# Altium project BDD_modul_ARM_v2.1.PrjPcb
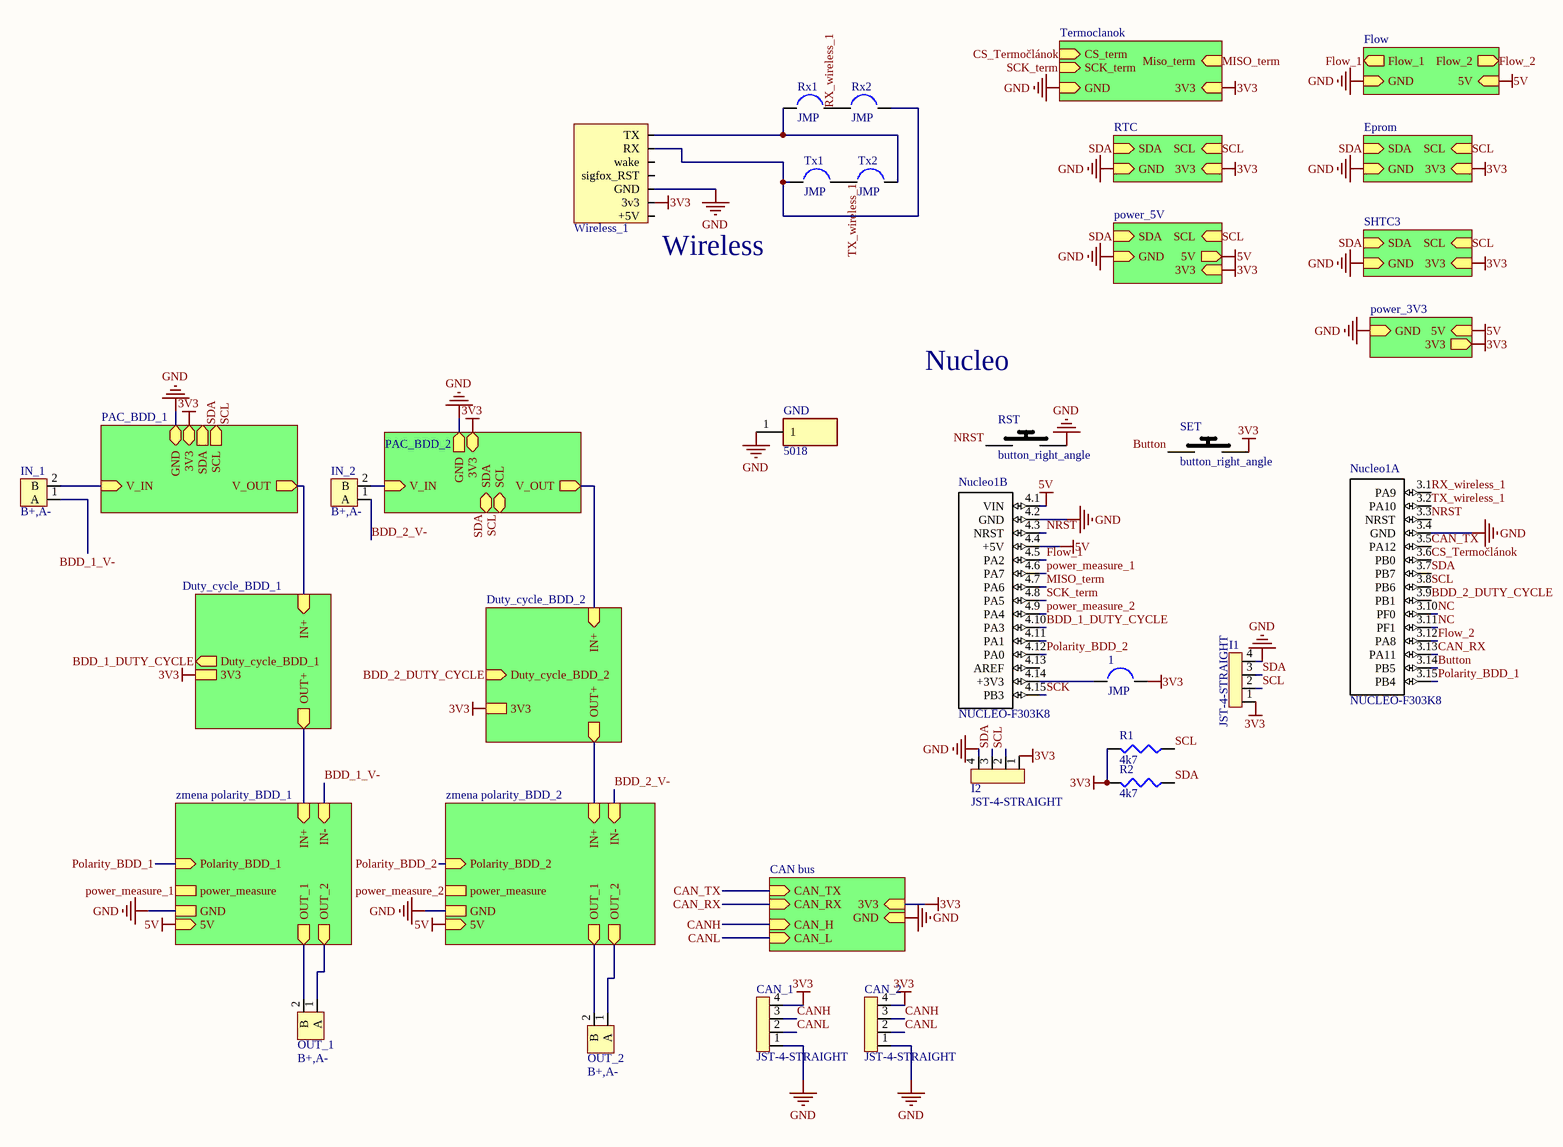
[diagram p0: BDD_modul_ARM_v2.1_Sheet.SchDoc]
16 sheets, 122 parts. Net scope: hierarchical (ports join the sheet entries above them; power ports are global).
Board files: BDD_modul_ARM_v2.1_PCB.PcbDoc, BDD_modul_ARM_v2.2_PCB.PcbDoc
Sheets:
  BDD_modul_ARM_v2.1_Sheet.SchDoc
    polarita_BDD_1 = zmena polarity_BDD_1.SchDoc
    polarita_BDD_2 = zmena polarity_BDD_2.SchDoc
    Duty_cycle_BDD_1 = Duty_cycle_BDD_1.SchDoc
    PAC_BDD_1 = PAC_BDD_1.SchDoc
    Duty_cycle_BDD_2 = Duty_cycle_BDD_2.SchDoc
    PAC_BDD_2 = PAC_BDD_2.SchDoc
    Designator = CAN bus.SchDoc
    Flow = Flow.SchDoc
    Eprom = Eprom.SchDoc
    Termoclanok = Termoclanok.SchDoc
    SHTC3 = SHTC3.SchDoc
    power_5V = power_5V.SchDoc
    power_3V3 = power_3V3.SchDoc
    RTC = RTC.SchDoc
  izolator.SchDoc

## Sheet BDD_modul_ARM_v2.1_Sheet.SchDoc
size A0

### Parts
(Parts that share a designator on the sheet are numbered #1, #2 ... from top to bottom, then left to right.)
1  JMP  [JMP]
CAN_1  JST-4-STRAIGHT  [JST-4-STRAIGHT]
CAN_2  JST-4-STRAIGHT  [JST-4-STRAIGHT]
GND#1  5018  [1508000150000030]
I1  JST-4-STRAIGHT  [JST-4-STRAIGHT]
I2  JST-4-STRAIGHT  [JST-4-STRAIGHT]
IN_1  B+,A-  [CON_2CH_PLUG]
IN_2  B+,A-  [CON_2CH_PLUG]
Nucleo1  NUCLEO-F303K8  [*MODULE_NUCLEO-F303K8_NUCLEO-F303K8(Primary)]  (parts A,B of 2)
OUT_1  B+,A-  [CON_2CH_PLUG]
OUT_2  B+,A-  [CON_2CH_PLUG]
R1  4k7  [J1-0603]
R2  4k7  [J1-0603]
RST  button_right_angle  [1825027-8]
Rx1  JMP  [JMP]
Rx2  JMP  [JMP]
SET  button_right_angle  [1825027-8]
Tx1  JMP  [JMP]
Tx2  JMP  [JMP]
Wireless_1  header7  [Wireless]  (value not drawn)

### Sub-sheets
Designator = CAN bus: 3V3 (in), CAN_TX (in), CAN_RX (in), GND (in), CAN_H (in), CAN_L (in)
Duty_cycle_BDD_1 = Duty_cycle_BDD_1: IN+ (in), OUT+ (out), Duty_cycle_BDD_1 (out), 3V3
Duty_cycle_BDD_2 = Duty_cycle_BDD_2: IN+ (in), OUT+ (out), Duty_cycle_BDD_2 (in), 3V3
Eprom = Eprom: 3V3 (in), GND (in), SDA (in), SCL (in)
Flow = Flow: GND (in), Flow_1 (out), Flow_2 (out), 5V (in)
PAC_BDD_1 = PAC_BDD_1: GND (bidir), 3V3 (bidir), V_IN (in), V_OUT (out), SDA (out), SCL (out)
PAC_BDD_2 = PAC_BDD_2: 3V3 (bidir), SDA (bidir), SCL (bidir), V_IN (in), V_OUT (out), GND (out)
polarita_BDD_1 = zmena polarity_BDD_1: Polarity_BDD_1 (in), IN+ (in), IN- (in), OUT_1 (out), OUT_2 (out), power_measure, GND, 5V (in)
polarita_BDD_2 = zmena polarity_BDD_2: Polarity_BDD_2 (in), IN+ (in), IN- (in), OUT_1 (out), OUT_2 (out), power_measure, GND, 5V (in)
power_3V3 = power_3V3: 5V (in), 3V3 (out), GND (in)
power_5V = power_5V: 5V (out), GND (in), SDA (in), SCL (in), 3V3 (in)
RTC = RTC: 3V3 (in), GND (in), SCL (in), SDA (in)
SHTC3 = SHTC3: SCL (in), SDA (in), GND (in), 3V3 (in)
Termoclanok = Termoclanok: 3V3 (in), Miso_term (in), GND (in), CS_term (in), SCK_term (in)

### Nets
3V3: 1.2 CAN_1.4 CAN_2.4 I1.1 I2.1 R1.2 R2.2 SET.2 Wireless_1.2(3v3) ; sheet Duty_cycle_BDD_1/3V3, sheet PAC_BDD_1/3V3, sheet Duty_cycle_BDD_2/3V3, sheet PAC_BDD_2/3V3, sheet Designator/3V3, sheet Eprom/3V3, sheet Termoclanok/3V3, sheet SHTC3/3V3, sheet power_5V/3V3, sheet power_3V3/3V3, sheet RTC/3V3
5V: Nucleo1.4.1(VIN) Nucleo1.4.4(+5V) ; sheet polarita_BDD_1/5V, sheet polarita_BDD_2/5V, sheet Flow/5V, sheet power_5V/5V, sheet power_3V3/5V
BDD1_Pac_+: IN_1.2(B) ; sheet PAC_BDD_1/V_IN
BDD1_Pac_-: sheet Duty_cycle_BDD_1/IN+, sheet PAC_BDD_1/V_OUT
BDD2_Pac_+: IN_2.2(B) ; sheet PAC_BDD_2/V_IN
BDD2_Pac_-: sheet Duty_cycle_BDD_2/IN+, sheet PAC_BDD_2/V_OUT
GND: CAN_1.1 CAN_2.1 GND#1.1 I1.4 I2.4 Nucleo1.3.4(GND) Nucleo1.4.2(GND) RST.2 Wireless_1.3(GND) ; sheet polarita_BDD_1/GND, sheet polarita_BDD_2/GND, sheet PAC_BDD_1/GND, sheet PAC_BDD_2/GND, sheet Designator/GND, sheet Flow/GND, sheet Eprom/GND, sheet Termoclanok/GND, sheet SHTC3/GND, sheet power_5V/GND, sheet power_3V3/GND, sheet RTC/GND
IN+_BDD_1: sheet polarita_BDD_1/IN+, sheet Duty_cycle_BDD_1/OUT+
IN+_BDD_2: sheet polarita_BDD_2/IN+, sheet Duty_cycle_BDD_2/OUT+
BDD_1_DUTY_CYCLE: Nucleo1.4.10(PA3) ; sheet Duty_cycle_BDD_1/Duty_cycle_BDD_1
BDD_1_V-: IN_1.1(A) ; sheet polarita_BDD_1/IN-
BDD_2_DUTY_CYCLE: Nucleo1.3.9(PB1) ; sheet Duty_cycle_BDD_2/Duty_cycle_BDD_2
BDD_2_V-: IN_2.1(A) ; sheet polarita_BDD_2/IN-
Button: Nucleo1.3.14(PB5) SET.1
CAN_RX: Nucleo1.3.13(PA11) ; sheet Designator/CAN_RX
CAN_TX: Nucleo1.3.5(PA12) ; sheet Designator/CAN_TX
CANH: CAN_1.3 CAN_2.3 ; sheet Designator/CAN_H
CANL: CAN_1.2 CAN_2.2 ; sheet Designator/CAN_L
CS_Termočlánok: Nucleo1.3.6(PB0) ; sheet Termoclanok/CS_term
Flow_1: Nucleo1.4.5(PA2) ; sheet Flow/Flow_1
Flow_2: Nucleo1.3.12(PA8) ; sheet Flow/Flow_2
MISO_term: Nucleo1.4.7(PA6) ; sheet Termoclanok/Miso_term
NC: Nucleo1.3.10(PF0) Nucleo1.3.11(PF1)
NRST: Nucleo1.3.3(NRST) Nucleo1.4.3(NRST) RST.1
OUT_1_BDD_1: OUT_1.2(B) ; sheet polarita_BDD_1/OUT_1
OUT_1_BDD_2: OUT_2.2(B) ; sheet polarita_BDD_2/OUT_1
OUT_2_BDD_1: OUT_1.1(A) ; sheet polarita_BDD_1/OUT_2
OUT_2_BDD_2: OUT_2.1(A) ; sheet polarita_BDD_2/OUT_2
Polarity_BDD_1: Nucleo1.3.15(PB4) ; sheet polarita_BDD_1/Polarity_BDD_1
Polarity_BDD_2: Nucleo1.4.12(PA0) ; sheet polarita_BDD_2/Polarity_BDD_2
power_measure_1: Nucleo1.4.6(PA7) ; sheet polarita_BDD_1/power_measure  [project net Measuring_voltage_1]
power_measure_2: Nucleo1.4.9(PA4) ; sheet polarita_BDD_2/power_measure  [project net Measuring_voltage_2]
RX_wireless_1: Nucleo1.3.1(PA9) Rx1.2 Rx2.1
SCK: Nucleo1.4.15(PB3)
SCK_term: Nucleo1.4.8(PA5) ; sheet Termoclanok/SCK_term
SCL: I1.2 I2.2 Nucleo1.3.8(PB6) R1.1 ; sheet PAC_BDD_1/SCL, sheet PAC_BDD_2/SCL, sheet Eprom/SCL, sheet SHTC3/SCL, sheet power_5V/SCL, sheet RTC/SCL
SDA: I1.3 I2.3 Nucleo1.3.7(PB7) R2.1 ; sheet PAC_BDD_1/SDA, sheet PAC_BDD_2/SDA, sheet Eprom/SDA, sheet SHTC3/SDA, sheet power_5V/SDA, sheet RTC/SDA
TX_wireless_1: Nucleo1.3.2(PA10) Tx1.2 Tx2.1
Net1_1: 1.1 Nucleo1.4.14(+3V3)
NetRx1_1: Rx1.1 Tx2.2 Wireless_1.7(TX)
NetRx2_2: Rx2.2 Tx1.1 Wireless_1.6(RX)

Not connected (* = marked no-connect by the designer): Nucleo1 4.11(PA1) 4.13(AREF); Wireless_1 1(+5V) 4(sigfox_RST) 5(wake)

### Notes on the sheet
- (near Wireless_1) Wireless
- Nucleo

### Library data of the parts
CAN_1 CAN_2 I1 I2 = JST-4-STRAIGHT: B4B-PH-K-S
GND#1 = 5018: Test Point; Manufacturer_Name: Keystone Electronics; Allied_Number: 71078148; Datasheet Link: https://www.keyelco.com/product-pdf.cfm?p=1356; Height: 2.29mm; Manufacturer_Part_Number: 5018; Mouser Part Number: 534-5018; Mouser Price/Stock: https://www.mouser.com/Search/Refine.aspx?Keyword=534-5018; Allied Price/Stock: https://www.alliedelec.com/keystone-electronics-5018/71078148/
IN_1 IN_2 OUT_1 OUT_2 = CON_2CH_PLUG: TBG-5.0-KW-2P
Nucleo1 = NUCLEO-F303K8: STM32 Nucleo-32 development board with STM32F303K8T6 MCU, supports Arduino connectivity; MF: STMicroelectronics; MP: NUCLEO-F303K8; Price: None; SnapEDA_Link: https://www.snapeda.com/parts/NUCLEO-F303K8/STMicroelectronics/view-part/?ref=snap; Availability: Unavailable; Package: None; Value: *
R1 R2 = Res3: Resistor; Value: 1K5; Published: 8-Jun-2000; LatestRevisionDate: 29-May-2009; LatestRevisionNote: IPC-7351 Footprint Added.; PackageReference: J1-0603; Publisher: Altium Limited; PackageDescription: Chip Resistor
RST SET = button_right_angle: Switch; Manufacturer_Name: TE Connectivity; Datasheet Link: http://www.te.com/commerce/DocumentDelivery/DDEController?Action=srchrtrv&DocNm=1825027&DocType=Customer+Drawing&DocLang=English; Manufacturer_Part_Number: 1825027-8; Mouser Part Number: 506-1825027-8; Mouser Price/Stock: https://www.mouser.com/Search/Refine.aspx?Keyword=506-1825027-8; RS Part Number: 7182389P; RS Price/Stock: http://uk.rs-online.com/web/p/products/7182389P
Wireless_1 = Wireless

## Sheet zmena polarity_BDD_1.SchDoc
size A4
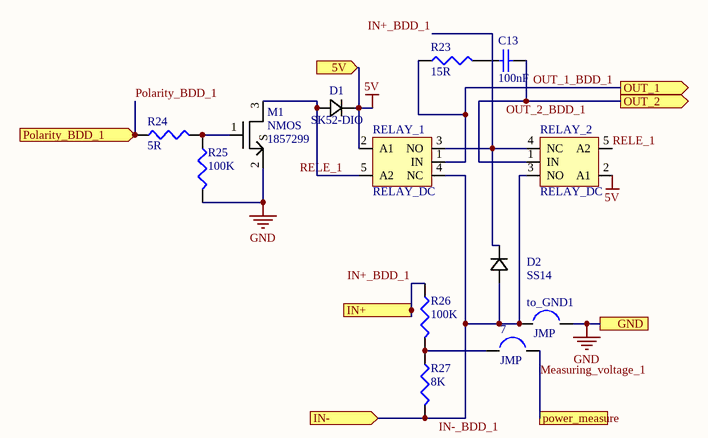
[diagram p1: zmena polarity_BDD_1.SchDoc]

### Parts
7  JMP  [JMP]
C13  100nF  [1608[0603]]
D1  SK52-DIO  [D5A20V]
D2  SS14  [D5A20V]
M1  NMOS  Supplier Part Number 1: 1857299  [SOT23]
R23  15R  [J1-0603]
R24  5R  [J1-0603]
R25  100K  [J1-0603]
R26  100K  [J1-0603]
R27  8K  [J1-0603]
RELAY_1  RELAY_DC  [RELAY_DC]
RELAY_2  RELAY_DC  [RELAY_DC]
to_GND1  JMP  [JMP]

### Ports
5V (in), GND, IN+ (in), IN- (in), OUT_1 (out), OUT_2 (out), Polarity_BDD_1 (in), power_measure

### Nets
5V: D1.1 RELAY_1.2(A1) RELAY_2.2(A1) ; port 5V
GND: M1.2(S) R25.2 to_GND1.2 ; port GND
IN+_BDD_1: D2.1 R26.1 RELAY_1.3(NO) RELAY_2.4(NC) ; port IN+
IN-_BDD_1: D2.2 R27.2 RELAY_1.4(NC) RELAY_2.3(NO) to_GND1.1 ; port IN-  [project net BDD_1_V-]
Measuring_voltage_1: 7.2 ; port power_measure
OUT_1_BDD_1: R23.1 RELAY_1.1(IN) ; port OUT_1
OUT_2_BDD_1: C13.2 RELAY_2.1(IN) ; port OUT_2
Polarity_BDD_1: R24.1 ; port Polarity_BDD_1
RELE_1: D1.2 M1.3(D) RELAY_1.5(A2) RELAY_2.5(A2)
Net7_1: 7.1 R26.2 R27.1
NetC13_1: C13.1 R23.2
NetM1_1: M1.1(G) R24.2 R25.1

### Library data of the parts
C13 = Cap Semi: Capacitor (Semiconductor SIM Model); Value: 100pF; Published: 8-Jun-2000; LatestRevisionDate: 29-May-2009; LatestRevisionNote: IPC-7351 Footprint Added.; PackageReference: C1206; Publisher: Altium Limited; PackageDescription: Chip Capacitor
D1 D2 = D_5A_20V
R23 = Res3: Resistor; Value: 2R; Published: 8-Jun-2000; LatestRevisionDate: 29-May-2009; LatestRevisionNote: IPC-7351 Footprint Added.; PackageReference: J1-0603; Publisher: Altium Limited; PackageDescription: Chip Resistor
R24-R27 = Res3: Resistor; Value: 200K; Published: 8-Jun-2000; LatestRevisionDate: 29-May-2009; LatestRevisionNote: IPC-7351 Footprint Added.; PackageReference: J1-0603; Publisher: Altium Limited; PackageDescription: Chip Resistor
RELAY_1 RELAY_2 = RELAY_DC: RM51-3011-85-1005
M1 = NMOS: Supplier 1: Farnell

## Sheet zmena polarity_BDD_2.SchDoc
size A0
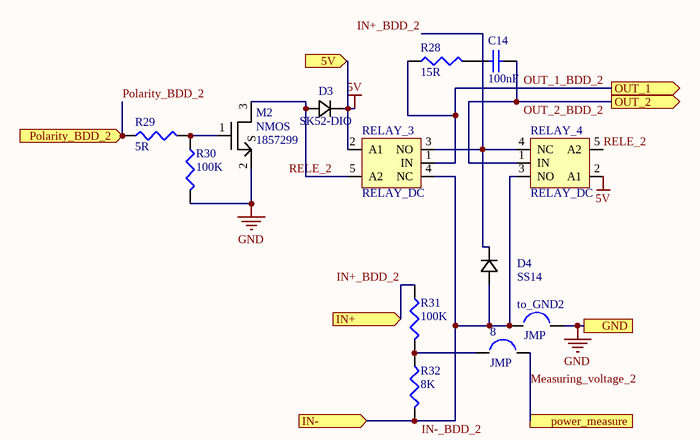
[diagram p2: zmena polarity_BDD_2.SchDoc]

### Parts
8  JMP  [JMP]
C14  100nF  [1608[0603]]
D3  SK52-DIO  [D5A20V]
D4  SS14  [D5A20V]
M2  NMOS  Supplier Part Number 1: 1857299  [SOT23]
R28  15R  [J1-0603]
R29  5R  [J1-0603]
R30  100K  [J1-0603]
R31  100K  [J1-0603]
R32  8K  [J1-0603]
RELAY_3  RELAY_DC  [RELAY_DC]
RELAY_4  RELAY_DC  [RELAY_DC]
to_GND2  JMP  [JMP]

### Ports
5V (in), GND, IN+ (in), IN- (in), OUT_1 (out), OUT_2 (out), Polarity_BDD_2 (in), power_measure

### Nets
5V: D3.1 RELAY_3.2(A1) RELAY_4.2(A1) ; port 5V
GND: M2.2(S) R30.2 to_GND2.2 ; port GND
IN+_BDD_2: D4.1 R31.1 RELAY_3.3(NO) RELAY_4.4(NC) ; port IN+
IN-_BDD_2: D4.2 R32.2 RELAY_3.4(NC) RELAY_4.3(NO) to_GND2.1 ; port IN-  [project net BDD_2_V-]
Measuring_voltage_2: 8.2 ; port power_measure
OUT_1_BDD_2: R28.1 RELAY_3.1(IN) ; port OUT_1
OUT_2_BDD_2: C14.2 RELAY_4.1(IN) ; port OUT_2
Polarity_BDD_2: R29.1 ; port Polarity_BDD_2
RELE_2: D3.2 M2.3(D) RELAY_3.5(A2) RELAY_4.5(A2)
Net8_1: 8.1 R31.2 R32.1
NetC14_1: C14.1 R28.2
NetM2_1: M2.1(G) R29.2 R30.1

### Library data of the parts
C14 = Cap Semi: as C13 on sheet zmena polarity_BDD_1; Published: 8-Jun-2000; LatestRevisionDate: 29-May-2009; LatestRevisionNote: IPC-7351 Footprint Added.; PackageReference: C1206; Publisher: Altium Limited; PackageDescription: Chip Capacitor
D3 D4 = D_5A_20V
R28 = Res3: Resistor; Value: 2R; Published: 8-Jun-2000; LatestRevisionDate: 29-May-2009; LatestRevisionNote: IPC-7351 Footprint Added.; PackageReference: J1-0603; Publisher: Altium Limited; PackageDescription: Chip Resistor
R29-R32 = Res3: Resistor; Value: 200K; Published: 8-Jun-2000; LatestRevisionDate: 29-May-2009; LatestRevisionNote: IPC-7351 Footprint Added.; PackageReference: J1-0603; Publisher: Altium Limited; PackageDescription: Chip Resistor
RELAY_3 RELAY_4 = RELAY_DC: RM51-3011-85-1005
M2 = NMOS: Supplier 1: Farnell

## Sheet Duty_cycle_BDD_1.SchDoc
size A4
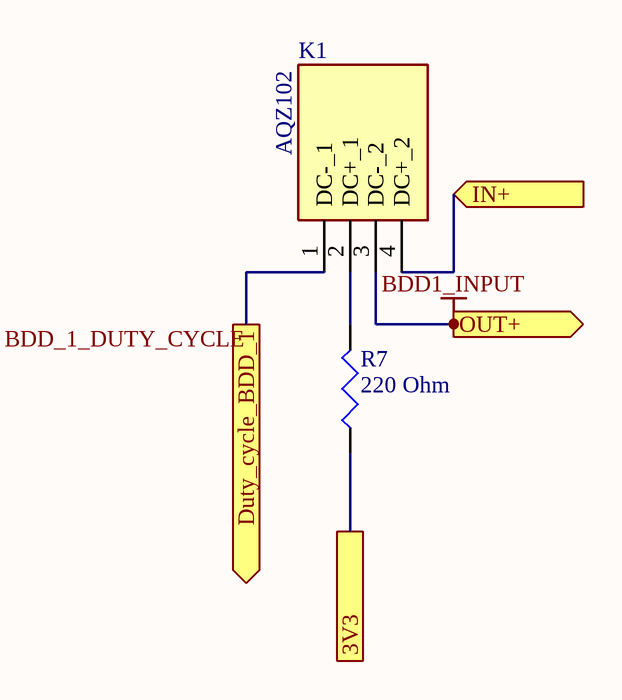
[diagram p3: Duty_cycle_BDD_1.SchDoc]

### Parts
K1  AQZ102  [AQZ102]
R7  220 Ohm  [J1-0603]

### Ports
3V3, Duty_cycle_BDD_1 (out), IN+ (in), OUT+ (out)

### Nets
3V3: R7.1 ; port 3V3
BDD1_INPUT: K1.3(DC-_2) ; port OUT+  [project net IN+_BDD_1]
BDD1_Pac_-: K1.4(DC+_2) ; port IN+
BDD_1_DUTY_CYCLE: K1.1(DC-_1) ; port Duty_cycle_BDD_1
NetK1_2: K1.2(DC+_1) R7.2

### Library data of the parts
K1 = AQZ102: Relay or Contactor; Manufacturer_Name: Panasonic; Datasheet Link: https://industrial.panasonic.com/ac/cdn/e/control/relay/photomos/catalog/semi_eng_pwr1a_aqz10_20.pdf; Height: 11mm; Manufacturer_Part_Number: AQZ102; Arrow Part Number: AQZ102; Arrow Price/Stock: https://www.arrow.com/en/products/aqz102/panasonic; Mouser Part Number: 769-AQZ102; Mouser Price/Stock: https://www.mouser.co.uk/ProductDetail/Panasonic-Industrial-Devices/AQZ102?qs=tR16lFwwUU%2FVYpsj8M3w%252BA%3D%3D
R7 = Res3: Resistor; Value: 10K; Published: 8-Jun-2000; LatestRevisionDate: 29-May-2009; LatestRevisionNote: IPC-7351 Footprint Added.; PackageReference: J1-0603; Publisher: Altium Limited; PackageDescription: Chip Resistor

## Sheet PAC_BDD_1.SchDoc
size A4
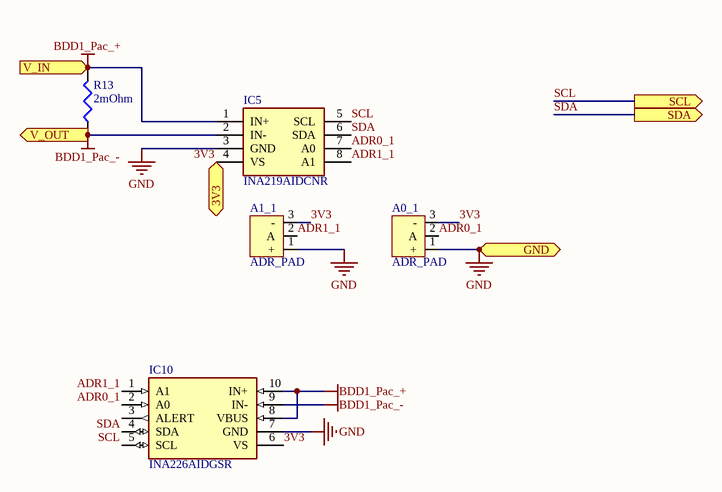
[diagram p4: PAC_BDD_1.SchDoc]

### Parts
A0_1  ADR_PAD  [SOLDER_PAD]
A1_1  ADR_PAD  [SOLDER_PAD]
IC5  INA219AIDCNR  [SOT65P280X145-8N]
IC10  INA226AIDGSR  [SOP50P490X110-10N]
R13  2mOhm  [RESC3216X75N]

### Ports
3V3 (bidir), GND (bidir), SCL (out), SDA (out), V_IN (in), V_OUT (out)

### Nets
3V3: A0_1.3(-) A1_1.3(-) IC5.4(VS) IC10.6(VS) ; port 3V3
BDD1_Pac_+: IC5.1(IN+) IC10.8(VBUS) IC10.10(IN+) R13.2 ; port V_IN
BDD1_Pac_-: IC5.2(IN-) IC10.9(IN-) R13.1 ; port V_OUT
GND: A0_1.1(+) A1_1.1(+) IC5.3(GND) IC10.7(GND) ; port GND
ADR0_1: A0_1.2(A) IC5.7(A0) IC10.2(A0)
ADR1_1: A1_1.2(A) IC5.8(A1) IC10.1(A1)
SCL: IC5.5(SCL) IC10.5(SCL) ; port SCL
SDA: IC5.6(SDA) IC10.4(SDA) ; port SDA

Not connected (* = marked no-connect by the designer): IC10 3(ALERT)

### Library data of the parts
A0_1 A1_1 = ADR_PAD: ADR PAD 3 PIN
IC5 = INA219BIDCNR: Integrated Circuit; Manufacturer_Name: Texas Instruments; Datasheet Link: http://www.ti.com/lit/ds/symlink/ina219.pdf; Height: 1.45mm; Manufacturer_Part_Number: INA219BIDCNR; Mouser Part Number: 595-INA219BIDCNR; Mouser Price/Stock: https://www.mouser.com/Search/Refine.aspx?Keyword=595-INA219BIDCNR
IC10 = INA226AIDGSR: Integrated Circuit; Manufacturer_Name: Texas Instruments; Datasheet Link: https://componentsearchengine.com/Datasheets/1/INA226AIDGSR.pdf; Height: 1.1mm; Manufacturer_Part_Number: INA226AIDGSR; Arrow Part Number: INA226AIDGSR; Arrow Price/Stock: https://www.arrow.com/en/products/ina226aidgsr/texas-instruments; Mouser Part Number: 595-INA226AIDGSR; Mouser Price/Stock: https://www.mouser.co.uk/ProductDetail/Texas-Instruments/INA226AIDGSR?qs=tQG3bEuiOZD4quG3egR36g%3D%3D
R13 = Res3: Resistor; Published: 8-Jun-2000; LatestRevisionDate: 29-May-2009; LatestRevisionNote: IPC-7351 Footprint Added.; PackageReference: J1-0603; Publisher: Altium Limited; PackageDescription: Chip Resistor; Value: 2mOhm

## Sheet Duty_cycle_BDD_2.SchDoc
size A4
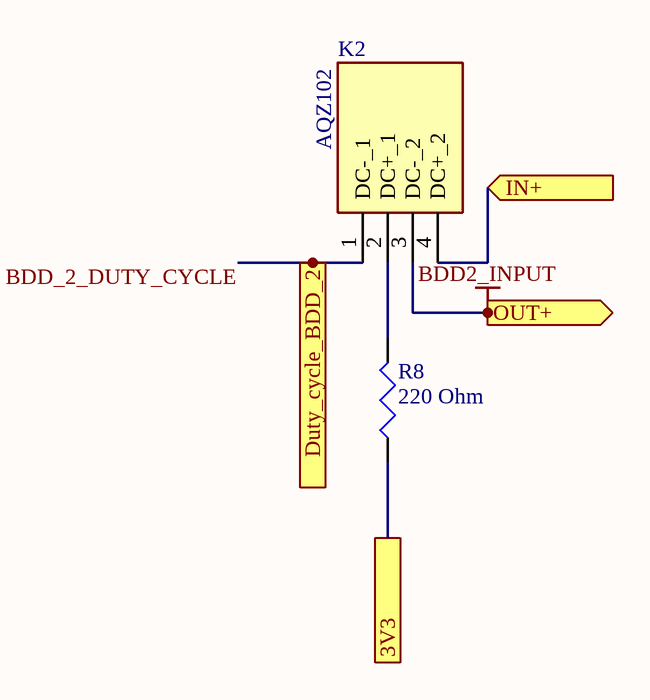
[diagram p5: Duty_cycle_BDD_2.SchDoc]

### Parts
K2  AQZ102  [AQZ102]
R8  220 Ohm  [J1-0603]

### Ports
3V3, Duty_cycle_BDD_2 (in), IN+ (in), OUT+ (out)

### Nets
3V3: R8.1 ; port 3V3
BDD2_INPUT: K2.3(DC-_2) ; port OUT+  [project net IN+_BDD_2]
BDD2_Pac_-: K2.4(DC+_2) ; port IN+
BDD_2_DUTY_CYCLE: K2.1(DC-_1) ; port Duty_cycle_BDD_2
NetK2_2: K2.2(DC+_1) R8.2

### Library data of the parts
K2 = AQZ102: as K1 on sheet Duty_cycle_BDD_1; Datasheet Link: https://industrial.panasonic.com/ac/cdn/e/control/relay/photomos/catalog/semi_eng_pwr1a_aqz10_20.pdf; Height: 11mm; Manufacturer_Part_Number: AQZ102; Arrow Part Number: AQZ102; Arrow Price/Stock: https://www.arrow.com/en/products/aqz102/panasonic; Mouser Part Number: 769-AQZ102; Mouser Price/Stock: https://www.mouser.co.uk/ProductDetail/Panasonic-Industrial-Devices/AQZ102?qs=tR16lFwwUU%2FVYpsj8M3w%252BA%3D%3D
R8 = Res3: Resistor; Value: 10K; Published: 8-Jun-2000; LatestRevisionDate: 29-May-2009; LatestRevisionNote: IPC-7351 Footprint Added.; PackageReference: J1-0603; Publisher: Altium Limited; PackageDescription: Chip Resistor

## Sheet PAC_BDD_2.SchDoc
size A4
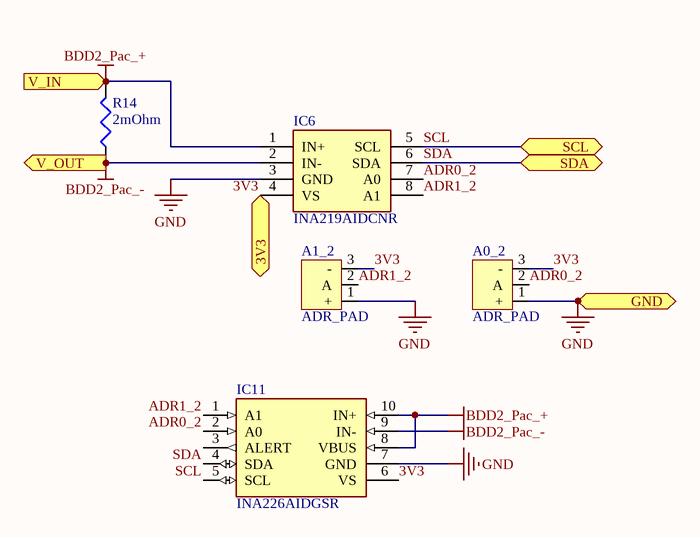
[diagram p6: PAC_BDD_2.SchDoc]

### Parts
A0_2  ADR_PAD  [SOLDER_PAD]
A1_2  ADR_PAD  [SOLDER_PAD]
IC6  INA219AIDCNR  [SOT65P280X145-8N]
IC11  INA226AIDGSR  [SOP50P490X110-10N]
R14  2mOhm  [RESC3216X75N]

### Ports
3V3 (bidir), GND (bidir), SCL (bidir), SDA (bidir), V_IN (in), V_OUT (out)

### Nets
3V3: A0_2.3(-) A1_2.3(-) IC6.4(VS) IC11.6(VS) ; port 3V3
BDD2_Pac_+: IC6.1(IN+) IC11.8(VBUS) IC11.10(IN+) R14.2 ; port V_IN
BDD2_Pac_-: IC6.2(IN-) IC11.9(IN-) R14.1 ; port V_OUT
GND: A0_2.1(+) A1_2.1(+) IC6.3(GND) IC11.7(GND) ; port GND
ADR0_2: A0_2.2(A) IC6.7(A0) IC11.2(A0)
ADR1_2: A1_2.2(A) IC6.8(A1) IC11.1(A1)
SCL: IC6.5(SCL) IC11.5(SCL) ; port SCL
SDA: IC6.6(SDA) IC11.4(SDA) ; port SDA

Not connected (* = marked no-connect by the designer): IC11 3(ALERT)

### Library data of the parts
A0_2 A1_2 = ADR_PAD: ADR PAD 3 PIN
IC6 = INA219BIDCNR: as IC5 on sheet PAC_BDD_1; Datasheet Link: http://www.ti.com/lit/ds/symlink/ina219.pdf; Height: 1.45mm; Manufacturer_Part_Number: INA219BIDCNR; Mouser Part Number: 595-INA219BIDCNR; Mouser Price/Stock: https://www.mouser.com/Search/Refine.aspx?Keyword=595-INA219BIDCNR
IC11 = INA226AIDGSR: as IC10 on sheet PAC_BDD_1; Datasheet Link: https://componentsearchengine.com/Datasheets/1/INA226AIDGSR.pdf; Height: 1.1mm; Manufacturer_Part_Number: INA226AIDGSR; Arrow Part Number: INA226AIDGSR; Arrow Price/Stock: https://www.arrow.com/en/products/ina226aidgsr/texas-instruments; Mouser Part Number: 595-INA226AIDGSR; Mouser Price/Stock: https://www.mouser.co.uk/ProductDetail/Texas-Instruments/INA226AIDGSR?qs=tQG3bEuiOZD4quG3egR36g%3D%3D
R14 = Res3: Resistor; Published: 8-Jun-2000; LatestRevisionDate: 29-May-2009; LatestRevisionNote: IPC-7351 Footprint Added.; PackageReference: J1-0603; Publisher: Altium Limited; PackageDescription: Chip Resistor; Value: 2mOhm

## Sheet CAN bus.SchDoc
size A4
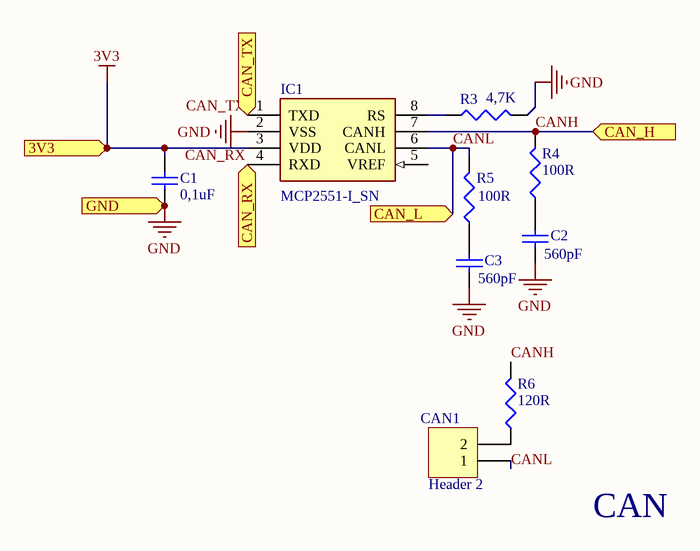
[diagram p7: CAN bus.SchDoc]

### Parts
C1  0,1uF  [1608[0603]]
C2  560pF  [1608[0603]]
C3  560pF  [1608[0603]]
CAN1  Header 2  [HDR1X2]
IC1  MCP2551-I_SN  [SOIC127P600X175-8N]
R3  4,7K  [J1-0603]
R4  100R  [J1-0603]
R5  100R  [J1-0603]
R6  120R  [J1-0603]

### Ports
3V3 (in), CAN_H (in), CAN_L (in), CAN_RX (in), CAN_TX (in), GND (in)

### Nets
3V3: C1.1 IC1.3(VDD) ; port 3V3
GND: C1.2 C2.2 C3.2 IC1.2(VSS) R3.2 ; port GND
CAN_RX: IC1.4(RXD) ; port CAN_RX
CAN_TX: IC1.1(TXD) ; port CAN_TX
CANH: IC1.7(CANH) R4.2 R6.2 ; port CAN_H
CANL: CAN1.1 IC1.6(CANL) R5.2 ; port CAN_L
NetC2_1: C2.1 R4.1
NetC3_1: C3.1 R5.1
NetCAN1_2: CAN1.2 R6.1
NetIC1_8: IC1.8(RS) R3.1

Not connected (* = marked no-connect by the designer): IC1 5(VREF)

### Notes on the sheet
- CAN

### Library data of the parts
C1-C3 = Cap Semi: as C13 on sheet zmena polarity_BDD_1; Published: 8-Jun-2000; LatestRevisionDate: 29-May-2009; LatestRevisionNote: IPC-7351 Footprint Added.; PackageReference: C1206; Publisher: Altium Limited; PackageDescription: Chip Capacitor
CAN1 = Header 2: Header, 2-Pin; LatestRevisionDate: 17-Jul-2002; LatestRevisionNote: Re-released for DXP Platform.; Publisher: Altium Limited
IC1 = MCP2551-I_SN: Integrated Circuit; Manufacturer_Name: Microchip; Manufacturer_Part_Number: MCP2551-I/SN; Allied_Number: 70045403; Datasheet Link: http://docs-emea.rs-online.com/webdocs/0a78/0900766b80a78cdb.pdf; Height: 1.75mm; Mouser Part Number: 579-MCP2551-I/SN; Mouser Price/Stock: https://www.mouser.com/Search/Refine.aspx?Keyword=579-MCP2551-I%2FSN; RS Part Number: 0402904P; RS Price/Stock: http://uk.rs-online.com/web/p/products/0402904P; Allied Price/Stock: http://www.alliedelec.com/microchip-technology-inc-mcp2551-i-sn/70045403/
R3-R6 = Res3: Resistor; Value: 3,3k; Published: 8-Jun-2000; LatestRevisionDate: 29-May-2009; LatestRevisionNote: IPC-7351 Footprint Added.; PackageReference: J1-0603; Publisher: Altium Limited; PackageDescription: Chip Resistor

## Sheet Flow.SchDoc
size A4
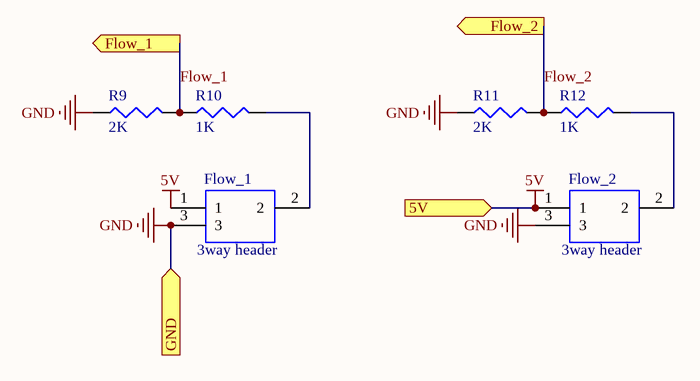
[diagram p8: Flow.SchDoc]

### Parts
Flow_1  3way header  [1725669]
Flow_2  3way header  [1725669]
R9  2K  [J1-0603]
R10  1K  [J1-0603]
R11  2K  [J1-0603]
R12  1K  [J1-0603]

### Ports
5V (in), Flow_1 (out), Flow_2 (out), GND (in)

### Nets
5V: Flow_1.1 Flow_2.1 ; port 5V
GND: Flow_1.3 Flow_2.3 R9.1 R11.1 ; port GND
Flow_1: R9.2 R10.1 ; port Flow_1
Flow_2: R11.2 R12.1 ; port Flow_2
NetFlow_1_2: Flow_1.2 R10.2
NetFlow_2_2: Flow_2.2 R12.2

### Library data of the parts
Flow_1 Flow_2 = 1725669: 3 way PCB vertical mount terminal,2.54mm 3 way PCB vertical mount terminal,2.54mm; Manufacturer_Name: Phoenix Contact; Allied_Number: 70054336; Manufacturer_Part_Number: 1725669; RS Part Number: 2204276; RS Price/Stock: http://uk.rs-online.com/web/p/products/2204276; Allied Price/Stock: http://www.alliedelec.com/phoenix-contact-1725669/70054336/; Arrow Part Number: 1725669; Arrow Price/Stock: https://www.arrow.com/en/products/1725669/phoenix-contact; Datasheet Link: http://uk.rs-online.com/web/p/products/2204276
R9-R12 = Res3: Resistor; Published: 8-Jun-2000; LatestRevisionDate: 29-May-2009; LatestRevisionNote: IPC-7351 Footprint Added.; PackageReference: J1-0603; Publisher: Altium Limited; PackageDescription: Chip Resistor
  R9 R11: Value: 2K
  R10 R12: Value: 1K

## Sheet Eprom.SchDoc
size A4
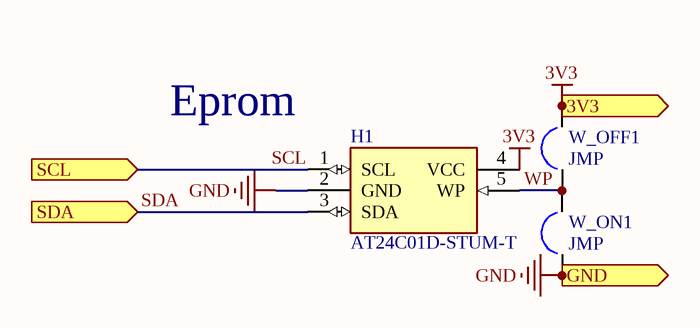
[diagram p9: Eprom.SchDoc]

### Parts
H1  AT24C01D-STUM-T  [SOT95P280X145-5N]
W_OFF1  JMP  [JMP]
W_ON1  JMP  [JMP]

### Ports
3V3 (in), GND (in), SCL (in), SDA (in)

### Nets
3V3: H1.4(VCC) W_OFF1.2 ; port 3V3
GND: H1.2(GND) W_ON1.1 ; port GND
SCL: H1.1(SCL) ; port SCL
SDA: H1.3(SDA) ; port SDA
WP: H1.5(WP) W_OFF1.1 W_ON1.2

### Notes on the sheet
- (near H1) Eprom

### Library data of the parts
H1 = AT24C01D-STUM-T: Hardware; Manufacturer_Name: Microchip; Datasheet Link: https://componentsearchengine.com/Datasheets/1/AT24C01D-STUM-T.pdf; Height: 1.45mm; Manufacturer_Part_Number: AT24C01D-STUM-T; Mouser Part Number: 556-AT24C01D-STUM-T; Mouser Price/Stock: https://www.mouser.com/Search/Refine.aspx?Keyword=556-AT24C01D-STUM-T; RS Part Number: 8988614; RS Price/Stock: https://uk.rs-online.com/web/p/products/8988614

## Sheet Termoclanok.SchDoc
size A
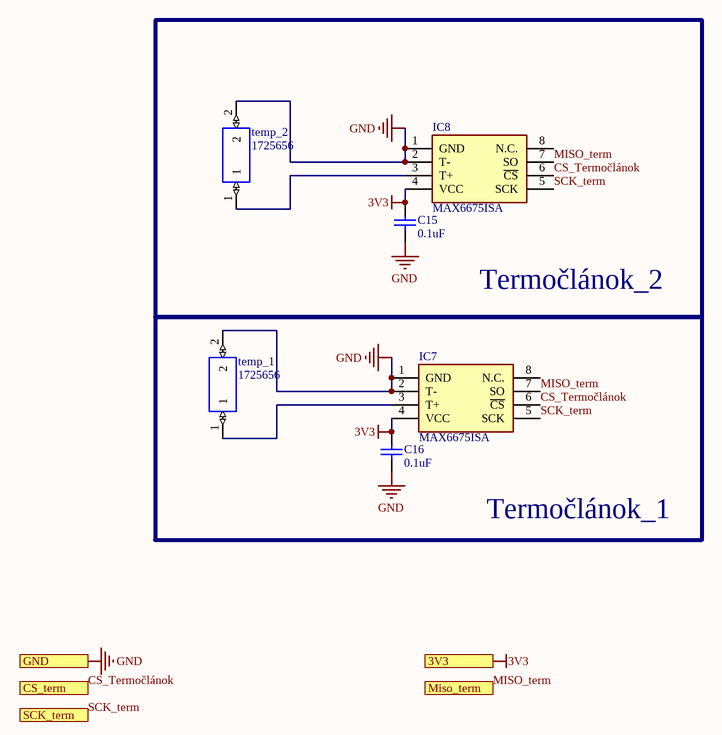
[diagram p10: Termoclanok.SchDoc]

### Parts
C15  0.1uF  [1608[0603]]
C16  0.1uF  [1608[0603]]
IC7  MAX6675ISA  [SOIC127P600X175-8N]
IC8  MAX6675ISA  [SOIC127P600X175-8N]
temp_1  1725656  [282834-2_1]
temp_2  1725656  [282834-2_1]

### Blocks framed on the sheet
Termočlánok_2: C15 IC8 temp_2
Termočlánok_1: C16 IC7 temp_1

### Ports
3V3 (in), CS_term (in), GND (in), Miso_term (in), SCK_term (in)

### Nets
3V3: C15.2 C16.2 IC7.4(VCC) IC8.4(VCC) ; port 3V3
GND: C15.1 C16.1 IC7.1(GND) IC7.2(T-) IC8.1(GND) IC8.2(T-) temp_1.2 temp_2.2 ; port GND
CS_Termočlánok: IC7.6(~{CS}) IC8.6(~{CS}) ; port CS_term
MISO_term: IC7.7(SO) IC8.7(SO) ; port Miso_term
SCK_term: IC7.5(SCK) IC8.5(SCK) ; port SCK_term
NetIC7_3: IC7.3(T+) temp_1.1
NetIC8_3: IC8.3(T+) temp_2.1

Not connected (* = marked no-connect by the designer): IC7 8(N.C.); IC8 8(N.C.)

### Library data of the parts
C15 C16 = Cap Semi: Capacitor (Semiconductor SIM Model); Published: 8-Jun-2000; LatestRevisionDate: 29-May-2009; LatestRevisionNote: IPC-7351 Footprint Added.; PackageReference: C1206; Publisher: Altium Limited; PackageDescription: Chip Capacitor; Value: 0.1uF
IC7 IC8 = MAX6675ISA: Integrated Circuit; Manufacturer_Name: Maxim Integrated; Datasheet Link: http://datasheets.maximintegrated.com/en/ds/MAX6675.pdf; Height: 1.75mm; Manufacturer_Part_Number: MAX6675ISA; Mouser Part Number: N/A; Mouser Price/Stock: https://www.mouser.com/Search/Refine.aspx?Keyword=N%2FA
temp_1 temp_2 = 1725656: 2 way PCB vertical mount terminal,2.54mm 2 way PCB vertical mount terminal,2.54mm; Manufacturer_Name: Phoenix Contact; Allied_Number: 70054335; Geometry.Height: 8mm; Manufacturer_Part_Number: 1725656; RS Part Number: 2204260; RS Price/Stock: http://uk.rs-online.com/web/p/products/2204260; Allied Price/Stock: http://www.alliedelec.com/phoenix-contact-1725656/70054335/; Arrow Part Number: 1725656; Arrow Price/Stock: https://www.arrow.com/en/products/1725656/phoenix-contact; Datasheet Link: https://www.phoenixcontact.com/online/portal/gb?uri=pxc-oc-itemdetail:pid=1725656&library=gben&tab=1

## Sheet SHTC3.SchDoc
size A4
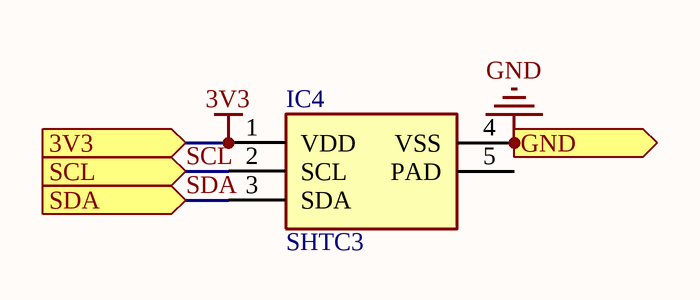
[diagram p11: SHTC3.SchDoc]

### Parts
IC4  SHTC3  [SHTC3]

### Ports
3V3 (in), GND (in), SCL (in), SDA (in)

### Nets
3V3: IC4.1(VDD) ; port 3V3
GND: IC4.4(VSS) ; port GND
SCL: IC4.2(SCL) ; port SCL
SDA: IC4.3(SDA) ; port SDA

Not connected (* = marked no-connect by the designer): IC4 5(PAD)

### Library data of the parts
IC4 = SHTC3: Integrated Circuit; Manufacturer_Name: Sensirion; Datasheet Link: https://www.glynshop.com/erp/owweb/Daten/Datenblaetter/Sensirion/SHTC3.pdf; Height: 0mm; Manufacturer_Part_Number: SHTC3; Mouser Part Number: 403-SHTC3; Mouser Price/Stock: https://www.mouser.com/Search/Refine.aspx?Keyword=403-SHTC3

## Sheet power_5V.SchDoc
size A4
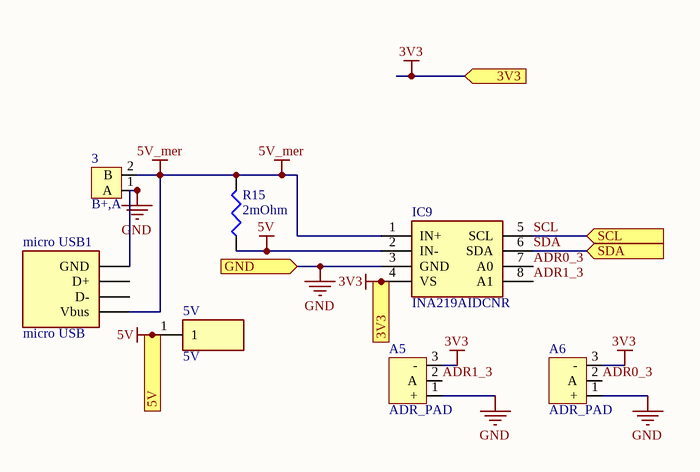
[diagram p12: power_5V.SchDoc]

### Parts
3  B+,A-  [CON_2CH_PLUG]
5V  5V  [1508000150000030]
A5  ADR_PAD  [SOLDER_PAD]
A6  ADR_PAD  [SOLDER_PAD]
IC9  INA219AIDCNR  [SOT65P280X145-8N]
micro_USB1  micro USB  [micro USB]
R15  2mOhm  [RESC3216X75N]

### Ports
3V3 (in), 5V (out), GND (in), SCL (in), SDA (in)

### Nets
3V3: A5.3(-) A6.3(-) IC9.4(VS) ; port 3V3
5V: 5V.1 IC9.2(IN-) R15.1 ; port 5V
5V_mer: 3.2(B) IC9.1(IN+) micro_USB1.1(Vbus) R15.2
GND: 3.1(A) A5.1(+) A6.1(+) IC9.3(GND) micro_USB1.5(GND) ; port GND
ADR0_3: A6.2(A) IC9.7(A0)
ADR1_3: A5.2(A) IC9.8(A1)
SCL: IC9.5(SCL) ; port SCL
SDA: IC9.6(SDA) ; port SDA

Not connected (* = marked no-connect by the designer): micro_USB1 2(D-) 3(D+)

### Library data of the parts
3 = CON_2CH_PLUG: TBG-5.0-KW-2P
5V = 5015: Undefined or Miscellaneous; Manufacturer_Name: Keystone Electronics; Allied_Number: 70182998; Datasheet Link: http://www.keyelco.com/product-pdf.cfm?p=1353; Height: 1.52mm; Manufacturer_Part_Number: 5015; Mouser Part Number: 534-5015; Mouser Price/Stock: https://www.mouser.com/Search/Refine.aspx?Keyword=534-5015; Allied Price/Stock: https://www.alliedelec.com/keystone-electronics-5015/70182998/
A5 A6 = ADR_PAD: ADR PAD 3 PIN
IC9 = INA219BIDCNR: as IC5 on sheet PAC_BDD_1; Datasheet Link: http://www.ti.com/lit/ds/symlink/ina219.pdf; Height: 1.45mm; Manufacturer_Part_Number: INA219BIDCNR; Mouser Part Number: 595-INA219BIDCNR; Mouser Price/Stock: https://www.mouser.com/Search/Refine.aspx?Keyword=595-INA219BIDCNR
R15 = Res3: Resistor; Published: 8-Jun-2000; LatestRevisionDate: 29-May-2009; LatestRevisionNote: IPC-7351 Footprint Added.; PackageReference: J1-0603; Publisher: Altium Limited; PackageDescription: Chip Resistor; Value: 2mOhm

## Sheet power_3V3.SchDoc
size A4
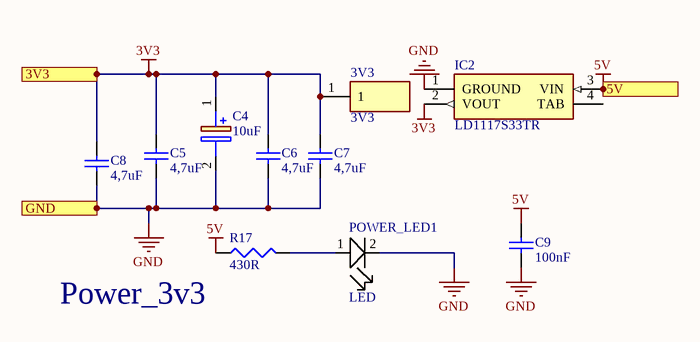
[diagram p13: power_3V3.SchDoc]

### Parts
(Parts that share a designator on the sheet are numbered #1, #2 ... from top to bottom, then left to right.)
3V3#1  3V3  [1508000150000030]
C4  10uF  [CAPPM3216X180N]
C5  4,7uF  [1608[0603]]
C6  4,7uF  [1608[0603]]
C7  4,7uF  [1608[0603]]
C8  4,7uF  [1608[0603]]
C9  100nF  [1608[0603]]
IC2  LD1117S33TR  [SOT230P700X180-4N]
POWER_LED1  LED  [LED5mA]
R17  430R  [J1-0603]

### Ports
3V3 (out), 5V (in), GND (in)

### Nets
3V3: 3V3#1.1 C4.1(+) C5.1 C6.1 C7.1 C8.1 IC2.2(VOUT) ; port 3V3
5V: C9.1 IC2.3(VIN) R17.1 ; port 5V
GND: C4.2(-) C5.2 C6.2 C7.2 C8.2 C9.2 IC2.1(GROUND) POWER_LED1.2 ; port GND
NetPOWER_LED1_1: POWER_LED1.1 R17.2

Not connected (* = marked no-connect by the designer): IC2 4(TAB)

### Notes on the sheet
- (near R17) Power_3v3

### Library data of the parts
3V3#1 = 5015: as 5V on sheet power_5V; Datasheet Link: http://www.keyelco.com/product-pdf.cfm?p=1353; Height: 1.52mm; Manufacturer_Part_Number: 5015; Mouser Part Number: 534-5015; Mouser Price/Stock: https://www.mouser.com/Search/Refine.aspx?Keyword=534-5015; Allied Price/Stock: https://www.alliedelec.com/keystone-electronics-5015/70182998/
C4 = TAJA106K004RNJ: Capacitor Polarised; Manufacturer_Name: AVX; Datasheet Link: http://www.farnell.com/datasheets/1680476.pdf; Height: 1.8mm; Manufacturer_Part_Number: TAJA106K004RNJ; Mouser Part Number: 581-TAJA106K004R; Mouser Price/Stock: https://www.mouser.com/Search/Refine.aspx?Keyword=581-TAJA106K004R
C5-C9 = Cap Semi: Capacitor; Value: 100pF; Published: 8-Jun-2000; LatestRevisionDate: 29-May-2009; LatestRevisionNote: IPC-7351 Footprint Added.; PackageReference: C1206; Publisher: Altium Limited; PackageDescription: Chip Capacitor
IC2 = LD1117S33TR: Integrated Circuit; Manufacturer_Name: STMicroelectronics; Allied_Number: 70390201; Datasheet Link: http://www.st.com/st-web-ui/static/active/en/resource/technical/document/datasheet/CD00000544.pdf; Height: 1.8mm; Manufacturer_Part_Number: LD1117S33TR; Mouser Part Number: 511-LD1117S33; Mouser Price/Stock: https://www.mouser.com/Search/Refine.aspx?Keyword=511-LD1117S33; RS Part Number: 7140697P; RS Price/Stock: http://uk.rs-online.com/web/p/products/7140697P; Allied Price/Stock: http://www.alliedelec.com/stmicroelectronics-ld1117s33tr/70390201/
R17 = Res3: Resistor; Published: 8-Jun-2000; LatestRevisionDate: 29-May-2009; LatestRevisionNote: IPC-7351 Footprint Added.; PackageReference: J1-0603; Publisher: Altium Limited; PackageDescription: Chip Resistor; Value: 430R

## Sheet RTC.SchDoc
size A4
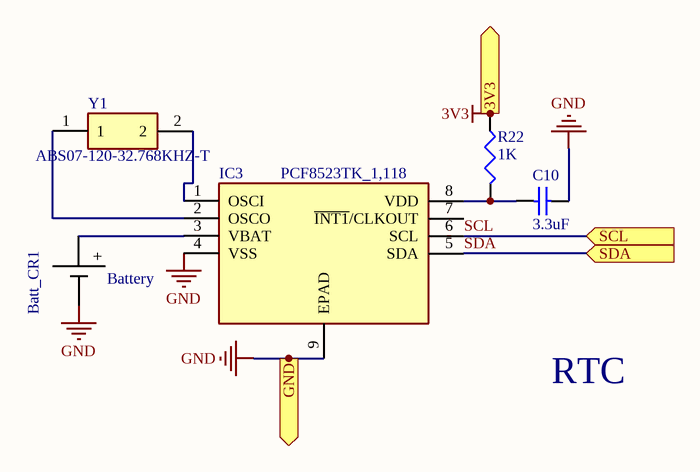
[diagram p14: RTC.SchDoc]

### Parts
Batt_CR1  Battery  [Battery 1220]
C10  3.3uF  [1608[0603]]
IC3  PCF8523TK_1,118  [SON80P400X400X100-9N]
R22  1K  [J1-0603]
Y1  ABS07-120-32.768KHZ-T  [ABS-07]

### Ports
3V3 (in), GND (in), SCL (in), SDA (in)

### Nets
3V3: R22.1 ; port 3V3
GND: Batt_CR1.2(-) C10.2 IC3.4(VSS) IC3.9(EPAD) ; port GND
SCL: IC3.6(SCL) ; port SCL
SDA: IC3.5(SDA) ; port SDA
NetBatt_CR1_1: Batt_CR1.1(+) IC3.3(VBAT)
NetC10_1: C10.1 IC3.8(VDD) R22.2
NetIC3_1: IC3.1(OSCI) Y1.2
NetIC3_2: IC3.2(OSCO) Y1.1

Not connected (* = marked no-connect by the designer): IC3 7(~{INT1}/CLKOUT)

### Notes on the sheet
- RTC

### Library data of the parts
Batt_CR1 = 1074: Undefined or Miscellaneous; Manufacturer_Name: Keystone Electronics; Datasheet Link: https://componentsearchengine.com/Datasheets/1/1074.pdf; Height: 18.3mm; Mouser Part Number: 534-1074; Mouser Price/Stock: https://www.mouser.com/Search/Refine.aspx?Keyword=534-1074; Manufacturer_Part_Number: 1074
C10 = Cap Semi: Capacitor (Semiconductor SIM Model); Published: 8-Jun-2000; LatestRevisionDate: 29-May-2009; LatestRevisionNote: IPC-7351 Footprint Added.; PackageReference: C1206; Publisher: Altium Limited; PackageDescription: Chip Capacitor; Value: 3.3uF
IC3 = PCF8523TK_1,118: Integrated Circuit; Manufacturer_Name: Nexperia; Manufacturer_Part_Number: PCF8523TK/1,118; Datasheet Link: https://www.arrow.com/en/products/pcf8523tk1118/nxp-semiconductors; Height: 1mm; Mouser Part Number: 771-PCF8523TK/1118; Mouser Price/Stock: https://www.mouser.com/Search/Refine.aspx?Keyword=771-PCF8523TK%2F1118
R22 = Res3: Resistor; Published: 8-Jun-2000; LatestRevisionDate: 29-May-2009; LatestRevisionNote: IPC-7351 Footprint Added.; PackageReference: J1-0603; Publisher: Altium Limited; PackageDescription: Chip Resistor; Value: 1K
Y1 = ABS07-120-32.768KHZ-T: Crystal or Oscillator; Manufacturer_Name: ABRACON; Datasheet Link: http://www.abracon.com/Resonators/ABS07-120-32.768kHz-T.pdf; Manufacturer_Part_Number: ABS07-120-32.768KHZ-T; Mouser Part Number: 815-ABS0712032.768KT; Mouser Price/Stock: https://www.mouser.com/Search/Refine.aspx?Keyword=815-ABS0712032.768KT; RS Part Number: 1712688P; RS Price/Stock: http://uk.rs-online.com/web/p/products/1712688P

## Sheet izolator.SchDoc
size A4
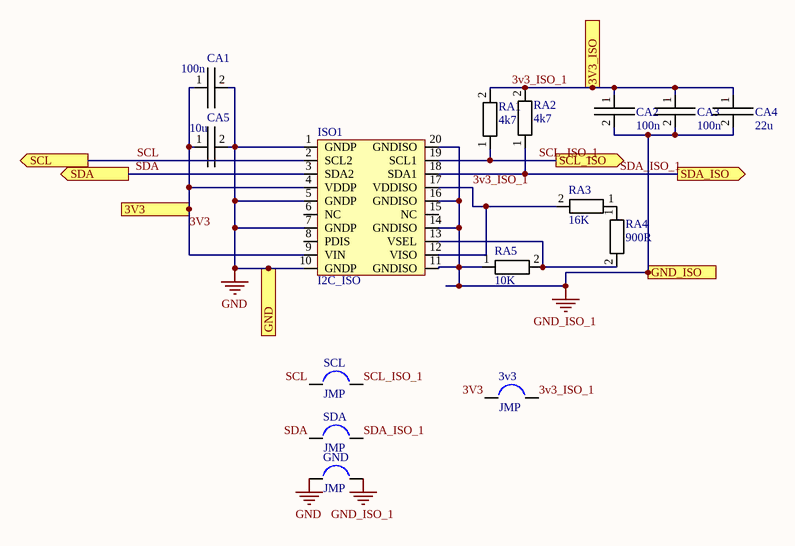
[diagram p15: izolator.SchDoc]

### Parts
(Parts that share a designator on the sheet are numbered #1, #2 ... from top to bottom, then left to right.)
3v3#2  JMP  [JMP]
CA1  100n  [Capacitor]
CA2  100n  [Capacitor]
CA3  100n  [Capacitor]
CA4  22u  [Capacitor]
CA5  10u  [Capacitor]
GND#2  JMP  [JMP]
ISO1  I2C_ISO  [SOP65P780X200-20N]
RA1  4k7  [Resistor]
RA2  4k7  [Resistor]
RA3  16K  [Resistor]
RA4  900R  [Resistor]
RA5  10K  [Resistor]
SCL  JMP  [JMP]
SDA  JMP  [JMP]

### Ports
3V3 (out), 3V3_ISO (out), GND (out), GND_ISO (out), SCL (out), SCL_ISO (out), SDA (out), SDA_ISO (out)

### Nets
GND: CA1.2 CA5.2 GND#2.1 ISO1.1(GNDP) ISO1.5(GNDP) ISO1.7(GNDP) ISO1.10(GNDP) ; port GND
GND_ISO_1: CA2.2 CA3.2 CA4.2 GND#2.2 ISO1.11(GNDISO) ISO1.14(GNDISO) ISO1.16(GNDISO) ISO1.20(GNDISO) RA5.1 ; port GND_ISO
3V3: 3v3#2.1 CA1.1 CA5.1 ISO1.4(VDDP) ISO1.9(VIN) ; port 3V3
3v3_ISO_1: 3v3#2.2 CA2.1 CA3.1 CA4.1 ISO1.12(VISO) ISO1.17(VDDISO) RA1.2 RA2.2 RA3.2 ; port 3V3_ISO
SCL: ISO1.2(SCL2) SCL.1 ; port SCL
SCL_ISO_1: ISO1.19(SCL1) RA1.1 SCL.2 ; port SCL_ISO
SDA: ISO1.3(SDA2) SDA.1 ; port SDA
SDA_ISO_1: ISO1.18(SDA1) RA2.1 SDA.2 ; port SDA_ISO
NetISO1_13: ISO1.13(VSEL) RA4.2 RA5.2
NetRA3_1: RA3.1 RA4.1

Not connected (* = marked no-connect by the designer): ISO1 6(NC) 8(PDIS) 15(NC)

### Library data of the parts
CA1-CA5 = Cap: Capacitor
ISO1 = I2C_ISO: ADM3260_mouser
RA1-RA5 = Resistor

## Nets that join several sheets
3V3: BDD_modul_ARM_v2.1_Sheet (9 pins), Duty_cycle_BDD_1 (R7.1), PAC_BDD_1 (A0_1.3 A1_1.3 IC5.4 IC10.6), Duty_cycle_BDD_2 (R8.1), PAC_BDD_2 (A0_2.3 A1_2.3 IC6.4 IC11.6), CAN bus (C1.1 IC1.3), Eprom (H1.4 W_OFF1.2), Termoclanok (C15.2 C16.2 IC7.4 IC8.4), SHTC3 (IC4.1), power_5V (A5.3 A6.3 IC9.4), power_3V3 (7 pins), RTC (R22.1)
5V: BDD_modul_ARM_v2.1_Sheet (Nucleo1.4.1 Nucleo1.4.4), zmena polarity_BDD_1 (D1.1 RELAY_1.2 RELAY_2.2), zmena polarity_BDD_2 (D3.1 RELAY_3.2 RELAY_4.2), Flow (Flow_1.1 Flow_2.1), power_5V (5V.1 IC9.2 R15.1), power_3V3 (C9.1 IC2.3 R17.1)
BDD1_Pac_+: BDD_modul_ARM_v2.1_Sheet (IN_1.2), PAC_BDD_1 (IC5.1 IC10.8 IC10.10 R13.2)
BDD1_Pac_-: Duty_cycle_BDD_1 (K1.4), PAC_BDD_1 (IC5.2 IC10.9 R13.1)
BDD2_Pac_+: BDD_modul_ARM_v2.1_Sheet (IN_2.2), PAC_BDD_2 (IC6.1 IC11.8 IC11.10 R14.2)
BDD2_Pac_-: Duty_cycle_BDD_2 (K2.4), PAC_BDD_2 (IC6.2 IC11.9 R14.1)
GND: BDD_modul_ARM_v2.1_Sheet (9 pins), zmena polarity_BDD_1 (M1.2 R25.2 to_GND1.2), zmena polarity_BDD_2 (M2.2 R30.2 to_GND2.2), PAC_BDD_1 (A0_1.1 A1_1.1 IC5.3 IC10.7), PAC_BDD_2 (A0_2.1 A1_2.1 IC6.3 IC11.7), CAN bus (5 pins), Flow (Flow_1.3 Flow_2.3 R9.1 R11.1), Eprom (H1.2 W_ON1.1), Termoclanok (8 pins), SHTC3 (IC4.4), power_5V (5 pins), power_3V3 (8 pins), RTC (Batt_CR1.2 C10.2 IC3.4 IC3.9), izolator (7 pins)
IN+_BDD_1: zmena polarity_BDD_1 (D2.1 R26.1 RELAY_1.3 RELAY_2.4), Duty_cycle_BDD_1 (K1.3)
IN+_BDD_2: zmena polarity_BDD_2 (D4.1 R31.1 RELAY_3.3 RELAY_4.4), Duty_cycle_BDD_2 (K2.3)
BDD_1_DUTY_CYCLE: BDD_modul_ARM_v2.1_Sheet (Nucleo1.4.10), Duty_cycle_BDD_1 (K1.1)
BDD_1_V-: BDD_modul_ARM_v2.1_Sheet (IN_1.1), zmena polarity_BDD_1 (5 pins)
BDD_2_DUTY_CYCLE: BDD_modul_ARM_v2.1_Sheet (Nucleo1.3.9), Duty_cycle_BDD_2 (K2.1)
BDD_2_V-: BDD_modul_ARM_v2.1_Sheet (IN_2.1), zmena polarity_BDD_2 (5 pins)
CAN_RX: BDD_modul_ARM_v2.1_Sheet (Nucleo1.3.13), CAN bus (IC1.4)
CAN_TX: BDD_modul_ARM_v2.1_Sheet (Nucleo1.3.5), CAN bus (IC1.1)
CANH: BDD_modul_ARM_v2.1_Sheet (CAN_1.3 CAN_2.3), CAN bus (IC1.7 R4.2 R6.2)
CANL: BDD_modul_ARM_v2.1_Sheet (CAN_1.2 CAN_2.2), CAN bus (CAN1.1 IC1.6 R5.2)
CS_Termočlánok: BDD_modul_ARM_v2.1_Sheet (Nucleo1.3.6), Termoclanok (IC7.6 IC8.6)
Flow_1: BDD_modul_ARM_v2.1_Sheet (Nucleo1.4.5), Flow (R9.2 R10.1)
Flow_2: BDD_modul_ARM_v2.1_Sheet (Nucleo1.3.12), Flow (R11.2 R12.1)
Measuring_voltage_1: BDD_modul_ARM_v2.1_Sheet (Nucleo1.4.6), zmena polarity_BDD_1 (7.2)
Measuring_voltage_2: BDD_modul_ARM_v2.1_Sheet (Nucleo1.4.9), zmena polarity_BDD_2 (8.2)
MISO_term: BDD_modul_ARM_v2.1_Sheet (Nucleo1.4.7), Termoclanok (IC7.7 IC8.7)
OUT_1_BDD_1: BDD_modul_ARM_v2.1_Sheet (OUT_1.2), zmena polarity_BDD_1 (R23.1 RELAY_1.1)
OUT_1_BDD_2: BDD_modul_ARM_v2.1_Sheet (OUT_2.2), zmena polarity_BDD_2 (R28.1 RELAY_3.1)
OUT_2_BDD_1: BDD_modul_ARM_v2.1_Sheet (OUT_1.1), zmena polarity_BDD_1 (C13.2 RELAY_2.1)
OUT_2_BDD_2: BDD_modul_ARM_v2.1_Sheet (OUT_2.1), zmena polarity_BDD_2 (C14.2 RELAY_4.1)
Polarity_BDD_1: BDD_modul_ARM_v2.1_Sheet (Nucleo1.3.15), zmena polarity_BDD_1 (R24.1)
Polarity_BDD_2: BDD_modul_ARM_v2.1_Sheet (Nucleo1.4.12), zmena polarity_BDD_2 (R29.1)
SCK_term: BDD_modul_ARM_v2.1_Sheet (Nucleo1.4.8), Termoclanok (IC7.5 IC8.5)
SCL: BDD_modul_ARM_v2.1_Sheet (I1.2 I2.2 Nucleo1.3.8 R1.1), PAC_BDD_1 (IC5.5 IC10.5), PAC_BDD_2 (IC6.5 IC11.5), Eprom (H1.1), SHTC3 (IC4.2), power_5V (IC9.5), RTC (IC3.6)
SDA: BDD_modul_ARM_v2.1_Sheet (I1.3 I2.3 Nucleo1.3.7 R2.1), PAC_BDD_1 (IC5.6 IC10.4), PAC_BDD_2 (IC6.6 IC11.4), Eprom (H1.3), SHTC3 (IC4.3), power_5V (IC9.6), RTC (IC3.5)